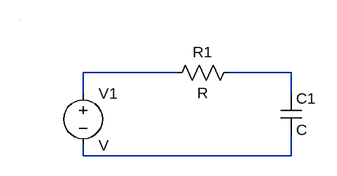
[diagram p0: schematic Draft2.asc]
Draft2.asc, the LTspice schematic file:
Version 4
SHEET 1 880 680
WIRE 240 80 96 80
WIRE 416 80 320 80
WIRE 96 112 96 80
WIRE 416 112 416 80
WIRE 96 208 96 192
WIRE 416 208 416 176
WIRE 416 208 96 208
WIRE 0 0 0 0
SYMBOL voltage 96 96 R0
SYMATTR InstName V1
SYMBOL cap 400 112 R0
SYMATTR InstName C1
SYMBOL res 336 64 R90
WINDOW 0 0 56 VBottom 2
WINDOW 3 32 56 VTop 2
SYMATTR InstName R1

The netlist it stands for:
* Draft2.asc
V1 N001 N003 V
C1 N002 N003 C
R1 N002 N001 R
.backanno
.end